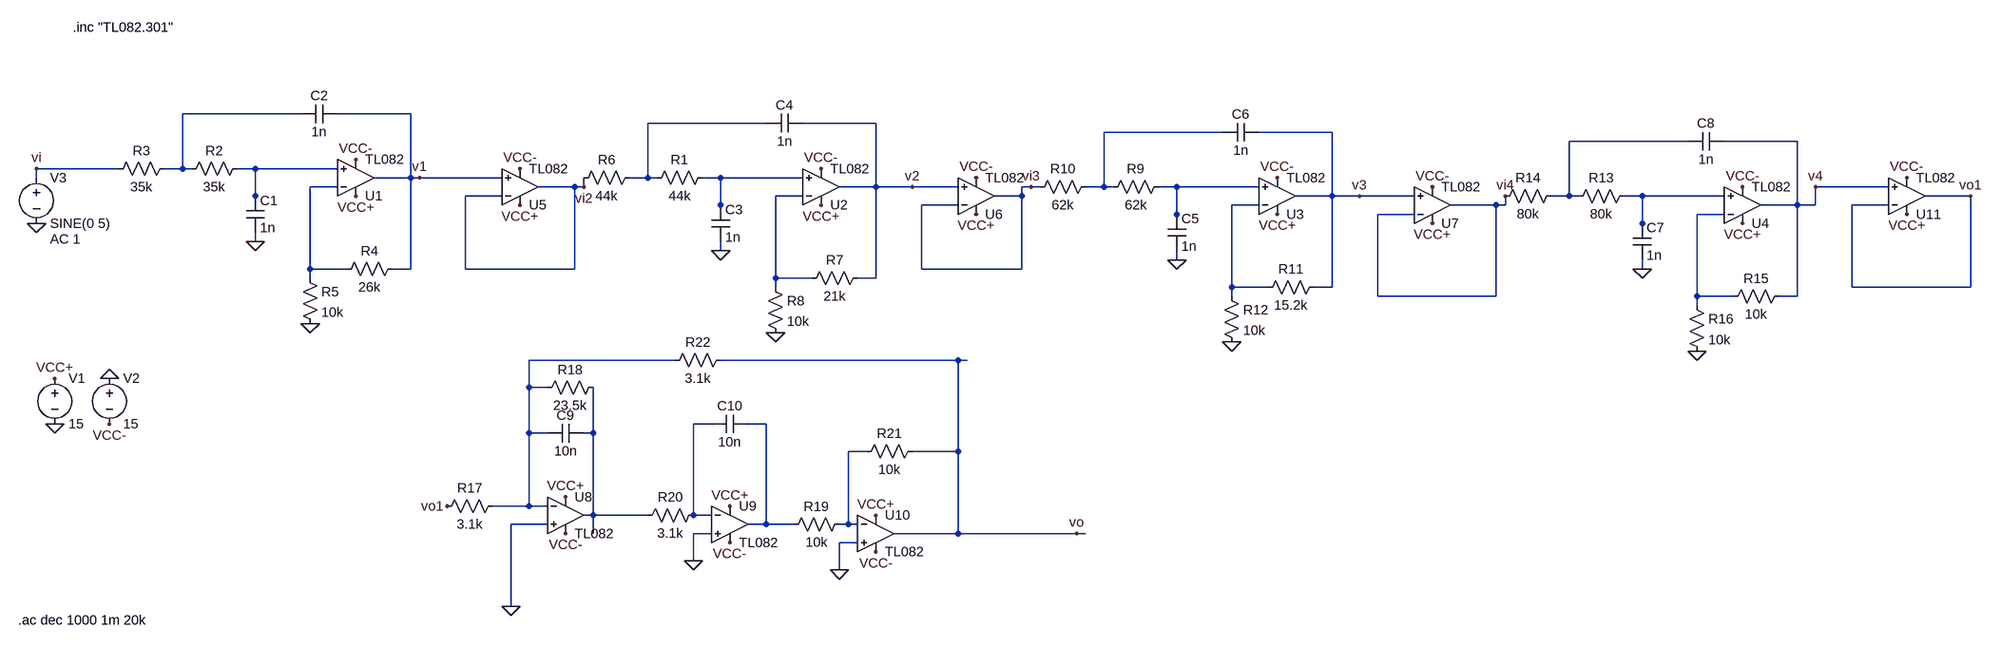
[diagram p0: schematic Filtro.asc]
Filtro.asc, the LTspice schematic file:
Version 4
SHEET 1 2548 1000
WIRE -416 96 -624 96
WIRE -224 96 -352 96
WIRE 400 112 192 112
WIRE 592 112 464 112
WIRE 1200 128 992 128
WIRE 1392 128 1264 128
WIRE 2016 144 1808 144
WIRE 2208 144 2080 144
WIRE -736 192 -880 192
WIRE -624 192 -624 96
WIRE -624 192 -656 192
WIRE -608 192 -624 192
WIRE -496 192 -528 192
WIRE -352 192 -496 192
WIRE -880 208 -880 192
WIRE -224 208 -224 96
WIRE -224 208 -288 208
WIRE -208 208 -224 208
WIRE -64 208 -208 208
WIRE 192 208 192 112
WIRE 192 208 160 208
WIRE 208 208 192 208
WIRE 320 208 288 208
WIRE 464 208 320 208
WIRE -352 224 -400 224
WIRE 64 224 0 224
WIRE 80 224 80 208
WIRE 80 224 64 224
WIRE 592 224 592 112
WIRE 592 224 528 224
WIRE 656 224 592 224
WIRE 736 224 656 224
WIRE 864 224 848 224
WIRE 880 224 864 224
WIRE 992 224 992 128
WIRE 992 224 960 224
WIRE 1008 224 992 224
WIRE 1120 224 1088 224
WIRE 1264 224 1120 224
WIRE 2368 224 2240 224
WIRE -496 240 -496 192
WIRE -64 240 -128 240
WIRE 464 240 416 240
WIRE 848 240 848 224
WIRE 848 240 800 240
WIRE 1392 240 1392 128
WIRE 1392 240 1328 240
WIRE 1440 240 1392 240
WIRE 1536 240 1440 240
WIRE 1808 240 1808 144
WIRE 1808 240 1776 240
WIRE 1824 240 1808 240
WIRE 1936 240 1904 240
WIRE 2080 240 1936 240
WIRE 2512 240 2432 240
WIRE -496 256 -496 240
WIRE 320 256 320 208
WIRE 736 256 672 256
WIRE 1264 256 1216 256
WIRE 1680 256 1600 256
WIRE 1696 256 1696 240
WIRE 1696 256 1680 256
WIRE 2208 256 2208 144
WIRE 2208 256 2144 256
WIRE 2240 256 2240 224
WIRE 2240 256 2208 256
WIRE 2368 256 2304 256
WIRE 320 272 320 256
WIRE 1120 272 1120 224
WIRE 1536 272 1472 272
WIRE 2080 272 2032 272
WIRE 1120 288 1120 272
WIRE 1936 288 1936 240
WIRE 1936 304 1936 288
WIRE -496 320 -496 304
WIRE 320 336 320 320
WIRE 1120 352 1120 336
WIRE -400 368 -400 224
WIRE -336 368 -400 368
WIRE -224 368 -224 208
WIRE -224 368 -256 368
WIRE -128 368 -128 240
WIRE 64 368 64 224
WIRE 64 368 -128 368
WIRE 672 368 672 256
WIRE 848 368 848 240
WIRE 848 368 672 368
WIRE 1936 368 1936 352
WIRE -400 384 -400 368
WIRE 416 384 416 240
WIRE 480 384 416 384
WIRE 592 384 592 224
WIRE 592 384 560 384
WIRE 416 400 416 384
WIRE 1216 400 1216 256
WIRE 1280 400 1216 400
WIRE 1392 400 1392 240
WIRE 1392 400 1360 400
WIRE 2304 400 2304 256
WIRE 2512 400 2512 240
WIRE 2512 400 2304 400
WIRE 1216 416 1216 400
WIRE 1472 416 1472 272
WIRE 1680 416 1680 256
WIRE 1680 416 1472 416
WIRE 2032 416 2032 272
WIRE 2096 416 2032 416
WIRE 2208 416 2208 256
WIRE 2208 416 2176 416
WIRE 2032 432 2032 416
WIRE 240 528 -16 528
WIRE 736 528 320 528
WIRE 752 528 736 528
WIRE -16 576 -16 528
WIRE 16 576 -16 576
WIRE 304 640 272 640
WIRE 400 640 368 640
WIRE -16 656 -16 576
WIRE 16 656 -16 656
WIRE 96 656 96 576
WIRE 96 656 80 656
WIRE 576 688 544 688
WIRE 736 688 736 528
WIRE 736 688 656 688
WIRE -16 784 -16 656
WIRE -16 784 -80 784
WIRE 16 784 -16 784
WIRE 96 800 96 656
WIRE 96 800 80 800
WIRE 192 800 96 800
WIRE 272 800 272 640
WIRE 304 800 272 800
WIRE 16 816 -48 816
WIRE 400 816 400 640
WIRE 400 816 368 816
WIRE 448 816 400 816
WIRE 544 816 544 688
WIRE 544 816 528 816
WIRE 560 816 544 816
WIRE 96 832 96 800
WIRE 304 832 272 832
WIRE 736 832 736 688
WIRE 736 832 624 832
WIRE 944 832 736 832
WIRE 960 832 944 832
WIRE 560 848 528 848
WIRE 272 880 272 832
WIRE 528 896 528 848
WIRE -48 960 -48 816
FLAG -848 640 0
FLAG -752 560 0
FLAG -848 560 VCC+
FLAG -752 640 VCC-
FLAG -320 176 VCC-
FLAG -320 240 VCC+
FLAG -496 320 0
FLAG -400 464 0
FLAG 496 192 VCC-
FLAG 496 256 VCC+
FLAG 320 336 0
FLAG 416 480 0
FLAG 1296 208 VCC-
FLAG 1296 272 VCC+
FLAG 1120 352 0
FLAG 1216 496 0
FLAG 2112 224 VCC-
FLAG 2112 288 VCC+
FLAG 1936 368 0
FLAG 2032 512 0
FLAG -32 192 VCC-
FLAG -32 256 VCC+
FLAG 768 208 VCC-
FLAG 768 272 VCC+
FLAG 1568 224 VCC-
FLAG 1568 288 VCC+
FLAG 48 768 VCC+
FLAG 48 832 VCC-
FLAG 336 784 VCC+
FLAG 336 848 VCC-
FLAG 592 800 VCC+
FLAG 592 864 VCC-
FLAG -160 784 vo1
FLAG 2400 208 VCC-
FLAG 2400 272 VCC+
FLAG 2512 240 vo1
FLAG 528 896 0
FLAG 272 880 0
FLAG -880 288 0
FLAG -48 960 0
FLAG 944 832 vo
FLAG -880 192 vi
FLAG -208 208 v1
FLAG 80 224 vi2
FLAG 656 224 v2
FLAG 864 224 vi3
FLAG 1440 240 v3
FLAG 1696 240 vi4
FLAG 2240 224 v4
SYMBOL Opamps\\opamp2 -320 272 M180
SYMATTR InstName U1
SYMATTR Value TL082
SYMBOL voltage -848 544 R0
WINDOW 123 0 0 Left 2
WINDOW 39 0 0 Left 2
SYMATTR InstName V1
SYMATTR Value 15
SYMBOL voltage -752 544 R0
WINDOW 123 0 0 Left 2
WINDOW 39 0 0 Left 2
SYMATTR InstName V2
SYMATTR Value 15
SYMBOL res -512 176 R90
WINDOW 0 0 56 VBottom 2
WINDOW 3 32 56 VTop 2
SYMATTR InstName R2
SYMATTR Value 35k
SYMBOL res -640 176 R90
WINDOW 0 0 56 VBottom 2
WINDOW 3 32 56 VTop 2
SYMATTR InstName R3
SYMATTR Value 35k
SYMBOL res -240 352 R90
WINDOW 0 0 56 VBottom 2
WINDOW 3 32 56 VTop 2
SYMATTR InstName R4
SYMATTR Value 26k
SYMBOL res -416 368 R0
SYMATTR InstName R5
SYMATTR Value 10k
SYMBOL cap -512 240 R0
SYMATTR InstName C1
SYMATTR Value 1n
SYMBOL cap -352 80 R90
WINDOW 0 0 32 VBottom 2
WINDOW 3 32 32 VTop 2
SYMATTR InstName C2
SYMATTR Value 1n
SYMBOL Opamps\\opamp2 496 288 M180
SYMATTR InstName U2
SYMATTR Value TL082
SYMBOL res 304 192 R90
WINDOW 0 0 56 VBottom 2
WINDOW 3 32 56 VTop 2
SYMATTR InstName R1
SYMATTR Value 44k
SYMBOL res 176 192 R90
WINDOW 0 0 56 VBottom 2
WINDOW 3 32 56 VTop 2
SYMATTR InstName R6
SYMATTR Value 44k
SYMBOL res 576 368 R90
WINDOW 0 0 56 VBottom 2
WINDOW 3 32 56 VTop 2
SYMATTR InstName R7
SYMATTR Value 21k
SYMBOL res 400 384 R0
SYMATTR InstName R8
SYMATTR Value 10k
SYMBOL cap 304 256 R0
SYMATTR InstName C3
SYMATTR Value 1n
SYMBOL cap 464 96 R90
WINDOW 0 0 32 VBottom 2
WINDOW 3 32 32 VTop 2
SYMATTR InstName C4
SYMATTR Value 1n
SYMBOL Opamps\\opamp2 1296 304 M180
SYMATTR InstName U3
SYMATTR Value TL082
SYMBOL res 1104 208 R90
WINDOW 0 0 56 VBottom 2
WINDOW 3 32 56 VTop 2
SYMATTR InstName R9
SYMATTR Value 62k
SYMBOL res 976 208 R90
WINDOW 0 0 56 VBottom 2
WINDOW 3 32 56 VTop 2
SYMATTR InstName R10
SYMATTR Value 62k
SYMBOL res 1376 384 R90
WINDOW 0 0 56 VBottom 2
WINDOW 3 32 56 VTop 2
SYMATTR InstName R11
SYMATTR Value 15.2k
SYMBOL res 1200 400 R0
SYMATTR InstName R12
SYMATTR Value 10k
SYMBOL cap 1104 272 R0
SYMATTR InstName C5
SYMATTR Value 1n
SYMBOL cap 1264 112 R90
WINDOW 0 0 32 VBottom 2
WINDOW 3 32 32 VTop 2
SYMATTR InstName C6
SYMATTR Value 1n
SYMBOL Opamps\\opamp2 2112 320 M180
SYMATTR InstName U4
SYMATTR Value TL082
SYMBOL res 1920 224 R90
WINDOW 0 0 56 VBottom 2
WINDOW 3 32 56 VTop 2
SYMATTR InstName R13
SYMATTR Value 80k
SYMBOL res 1792 224 R90
WINDOW 0 0 56 VBottom 2
WINDOW 3 32 56 VTop 2
SYMATTR InstName R14
SYMATTR Value 80k
SYMBOL res 2192 400 R90
WINDOW 0 0 56 VBottom 2
WINDOW 3 32 56 VTop 2
SYMATTR InstName R15
SYMATTR Value 10k
SYMBOL res 2016 416 R0
SYMATTR InstName R16
SYMATTR Value 10k
SYMBOL cap 1920 288 R0
SYMATTR InstName C7
SYMATTR Value 1n
SYMBOL cap 2080 128 R90
WINDOW 0 0 32 VBottom 2
WINDOW 3 32 32 VTop 2
SYMATTR InstName C8
SYMATTR Value 1n
SYMBOL Opamps\\opamp2 -32 288 M180
SYMATTR InstName U5
SYMATTR Value TL082
SYMBOL Opamps\\opamp2 768 304 M180
SYMATTR InstName U6
SYMATTR Value TL082
SYMBOL Opamps\\opamp2 1568 320 M180
SYMATTR InstName U7
SYMATTR Value TL082
SYMBOL res -64 768 R90
WINDOW 0 0 56 VBottom 2
WINDOW 3 32 56 VTop 2
SYMATTR InstName R17
SYMATTR Value 3.1k
SYMBOL res 112 560 R90
WINDOW 0 0 56 VBottom 2
WINDOW 3 32 56 VTop 2
SYMATTR InstName R18
SYMATTR Value 23.5k
SYMBOL cap 80 640 R90
WINDOW 0 0 32 VBottom 2
WINDOW 3 32 32 VTop 2
SYMATTR InstName C9
SYMATTR Value 10n
SYMBOL res 288 784 R90
WINDOW 0 0 56 VBottom 2
WINDOW 3 32 56 VTop 2
SYMATTR InstName R20
SYMATTR Value 3.1k
SYMBOL Opamps\\opamp2 48 736 R0
SYMATTR InstName U8
SYMATTR Value TL082
SYMBOL Opamps\\opamp2 336 752 R0
SYMATTR InstName U9
SYMATTR Value TL082
SYMBOL Opamps\\opamp2 592 768 R0
SYMATTR InstName U10
SYMATTR Value TL082
SYMBOL cap 368 624 R90
WINDOW 0 0 32 VBottom 2
WINDOW 3 32 32 VTop 2
SYMATTR InstName C10
SYMATTR Value 10n
SYMBOL res 544 800 R90
WINDOW 0 0 56 VBottom 2
WINDOW 3 32 56 VTop 2
SYMATTR InstName R19
SYMATTR Value 10k
SYMBOL res 672 672 R90
WINDOW 0 0 56 VBottom 2
WINDOW 3 32 56 VTop 2
SYMATTR InstName R21
SYMATTR Value 10k
SYMBOL res 336 512 R90
WINDOW 0 0 56 VBottom 2
WINDOW 3 32 56 VTop 2
SYMATTR InstName R22
SYMATTR Value 3.1k
SYMBOL Opamps\\opamp2 2400 304 M180
SYMATTR InstName U11
SYMATTR Value TL082
SYMBOL voltage -880 192 R0
WINDOW 123 24 124 Left 2
WINDOW 39 0 0 Left 2
SYMATTR Value2 AC 1
SYMATTR InstName V3
SYMATTR Value SINE(0 5)
TEXT -816 -88 Left 2 !.inc "TL082.301"
TEXT -912 984 Left 2 !.ac dec 1000 1m 20k

The netlist it stands for:
* Filtro.asc
XU1 N005 N007 VCC+ VCC- v1 TL082  ; pins In+ In- V+ V- OUT
V1 VCC+ 0 15
V2 0 VCC- 15
R2 N005 N001 35k
R3 N001 vi 35k
R4 v1 N007 26k
R5 N007 0 10k
C1 N005 0 1n
C2 v1 N001 1n
XU2 N006 N009 VCC+ VCC- v2 TL082  ; pins In+ In- V+ V- OUT
R1 N006 N002 44k
R6 N002 vi2 44k
R7 v2 N009 21k
R8 N009 0 10k
C3 N006 0 1n
C4 v2 N002 1n
XU3 N008 N011 VCC+ VCC- v3 TL082  ; pins In+ In- V+ V- OUT
R9 N008 N003 62k
R10 N003 vi3 62k
R11 v3 N011 15.2k
R12 N011 0 10k
C5 N008 0 1n
C6 v3 N003 1n
XU4 N010 N012 VCC+ VCC- v4 TL082  ; pins In+ In- V+ V- OUT
R13 N010 N004 80k
R14 N004 vi4 80k
R15 v4 N012 10k
R16 N012 0 10k
C7 N010 0 1n
C8 v4 N004 1n
XU5 v1 vi2 VCC+ VCC- vi2 TL082  ; pins In+ In- V+ V- OUT
XU6 v2 vi3 VCC+ VCC- vi3 TL082  ; pins In+ In- V+ V- OUT
XU7 v3 vi4 VCC+ VCC- vi4 TL082  ; pins In+ In- V+ V- OUT
R17 N013 vo1 3.1k
R18 N016 N013 23.5k
C9 N016 N013 10n
R20 N014 N016 3.1k
XU8 0 N013 VCC+ VCC- N016 TL082  ; pins In+ In- V+ V- OUT
XU9 0 N014 VCC+ VCC- N015 TL082  ; pins In+ In- V+ V- OUT
XU10 0 N017 VCC+ VCC- vo TL082  ; pins In+ In- V+ V- OUT
C10 N015 N014 10n
R19 N017 N015 10k
R21 vo N017 10k
R22 vo N013 3.1k
XU11 v4 vo1 VCC+ VCC- vo1 TL082  ; pins In+ In- V+ V- OUT
V3 vi 0 SINE(0 5) AC 1
.inc "TL082.301"
.ac dec 1000 1m 20k
.backanno
.end